# EAGLE design ISP (EAGLE 6.3)
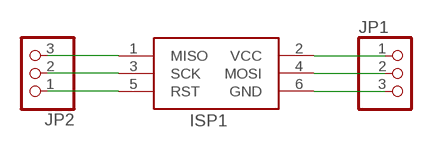
[diagram p0: schematic, sheet 1]

## Parts
ISP1  AVRISP-6  [AVRISP]
JP1  PINHD-1X3  [1X03]
JP2  PINHD-1X3  [1X03]

## Nets
N$1: ISP1.2(VCC) JP1.1
N$2: ISP1.4(MOSI) JP1.2
N$3: ISP1.6(GND) JP1.3
N$4: ISP1.5(RST) JP2.1
N$5: ISP1.3(SCK) JP2.2
N$6: ISP1.1(MISO) JP2.3

## Library data of the parts
ISP1 = adafruit_mod:AVRISP: AVR ISP HEADER Standard 6 pin header for AVR programming
JP1 JP2 = adafruit_mod:PINHD-1X3: PIN HEADER

## Board
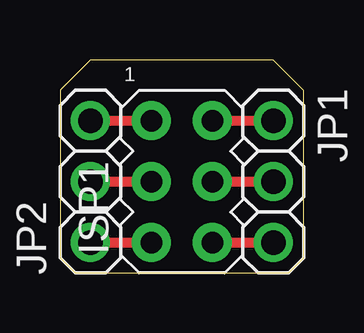
[diagram p1: board, top side]

Size 10.16 x 8.89 mm. Coordinates in mm from the lower left corner, seen from the top.
Outline: 1.26,8.88 0,7.62 0,0.64 0.64,0 9.53,0 10.16,0.64 10.16,7.61 8.89,8.89 3.81,8.89 3.8,8.88 1.26,8.88
Copper layers (1*16): Top 0.035mm / dielectric 1.5mm / Bottom 0.035mm
Design rules "SparkFun": minimum track width 8mil, minimum drill 20mil, track to track 8mil, track to pad 8mil, pad to pad 8mil, via to via 8mil, smd to smd 8mil, copper to edge 10mil, drill to drill 8mil, minimum pad ring 12mil, minimum via ring 10mil, stop-mask expansion 4mil, vias tented up to drill 25mil, thermal gap 10mil

### Footprints (pad centres in the part's own frame; a part is rotated, then mirrored left to right if it is on the bottom)
AVRISP = drill 0.9 pad 1.626: 1 -1.27,2.54; 2 1.27,2.54; 3 -1.27,0; 4 1.27,0; 5 -1.27,-2.54; 6 1.27,-2.54
1X03 = drill 1.016: 1 -2.54,0; 2 0,0; 3 2.54,0

### Placement (x,y rotation side)
ISP1  5.08,3.81 0 top
JP1  8.89,3.81 270 top
JP2  1.27,3.81 90 top

### Tracks (layer width: path | path; a pad name or v marks a point on that pad's centre or on a via)
N$1
  Top 0.406: ISP1.2 JP1.1
N$2
  Top 0.406: ISP1.4 JP1.2
N$3
  Top 0.406: ISP1.6 JP1.3
N$4
  Top 0.406: JP2.1 ISP1.5
N$5
  Top 0.406: JP2.2 ISP1.3
N$6
  Top 0.406: JP2.3 ISP1.1

### Text on the board
tDocu: MISO | ISP | VCC | SCK | MOSI | RST | GND
bDocu: MakersBox